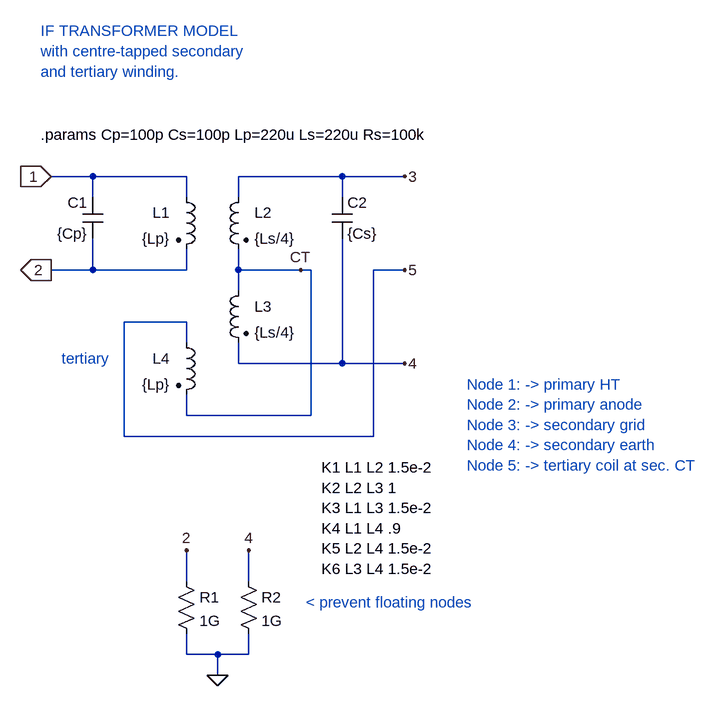
[diagram p0: schematic FM IF detector coil TX master.asc]
FM IF detector coil TX master.asc, the LTspice schematic file:
Version 4
SHEET 1 1056 868
WIRE -128 -48 -192 -48
WIRE 16 -48 -128 -48
WIRE 256 -48 96 -48
WIRE 352 -48 256 -48
WIRE -128 -16 -128 -48
WIRE 16 -16 16 -48
WIRE 96 -16 96 -48
WIRE 256 -16 256 -48
WIRE -128 96 -128 48
WIRE -128 96 -192 96
WIRE 16 96 16 64
WIRE 16 96 -128 96
WIRE 96 96 96 64
WIRE 192 96 96 96
WIRE 208 96 192 96
WIRE 352 96 304 96
WIRE 96 128 96 96
WIRE 16 176 -80 176
WIRE 16 208 16 176
WIRE 96 240 96 208
WIRE 256 240 256 48
WIRE 256 240 96 240
WIRE 352 240 256 240
WIRE 16 320 16 288
WIRE 208 320 208 96
WIRE 208 320 16 320
WIRE -80 352 -80 176
WIRE 304 352 304 96
WIRE 304 352 -80 352
WIRE 16 576 16 528
WIRE 112 576 112 528
WIRE 16 688 16 656
WIRE 64 688 16 688
WIRE 112 688 112 656
WIRE 112 688 64 688
WIRE 64 720 64 688
FLAG 64 720 0
FLAG 16 528 2
FLAG 112 528 4
FLAG -192 -48 1
IOPIN -192 -48 In
FLAG -192 96 2
IOPIN -192 96 Out
FLAG 352 -48 3
FLAG 352 240 4
FLAG 352 96 5
FLAG 192 96 CT
SYMBOL res 0 560 R0
SYMATTR InstName R1
SYMATTR Value 1G
SYMBOL res 96 560 R0
SYMATTR InstName R2
SYMATTR Value 1G
SYMBOL ind2 0 -32 R0
WINDOW 0 -9 40 Right 0
WINDOW 3 -9 80 Right 0
SYMATTR InstName L1
SYMATTR Value {Lp}
SYMATTR Type ind
SYMATTR SpiceLine Rser=1 Rpar=100k
SYMBOL ind2 112 -32 M0
WINDOW 0 -9 40 Right 0
WINDOW 3 -9 80 Right 0
SYMATTR InstName L2
SYMATTR Value {Ls/4}
SYMATTR Type ind
SYMATTR SpiceLine Rser=1 Rpar={Rs/2}
SYMBOL ind2 112 112 M0
WINDOW 0 -9 40 Right 0
WINDOW 3 -9 80 Right 0
SYMATTR InstName L3
SYMATTR Value {Ls/4}
SYMATTR Type ind
SYMATTR SpiceLine Rser=1 Rpar={Rs/2}
SYMBOL cap -112 -16 M0
SYMATTR InstName C1
SYMATTR Value {Cp}
SYMBOL cap 240 -16 R0
SYMATTR InstName C2
SYMATTR Value {Cs}
SYMBOL ind2 0 192 R0
WINDOW 0 -9 40 Right 0
WINDOW 3 -9 80 Right 0
SYMATTR InstName L4
SYMATTR Value {Lp}
SYMATTR Type ind
SYMATTR SpiceLine Rser=1
TEXT -208 -272 Left 0 ;IF TRANSFORMER MODEL\nwith centre-tapped secondary\nand tertiary winding.
TEXT 448 272 Left 0 ;Node 1: -> primary HT\nNode 2: -> primary anode\nNode 3: -> secondary grid\nNode 4: -> secondary earth\nNode 5: -> tertiary coil at sec. CT
TEXT 200 608 Left 0 ;< prevent floating nodes
TEXT -208 -112 Left 0 !.params Cp=100p Cs=100p Lp=220u Ls=220u Rs=100k
TEXT -176 232 Left 0 ;tertiary
TEXT 224 400 Left 0 !K1 L1 L2 1.5e-2\nK2 L2 L3 1\nK3 L1 L3 1.5e-2\nK4 L1 L4 .9\nK5 L2 L4 1.5e-2\nK6 L3 L4 1.5e-2

The netlist it stands for:
* FM IF detector coil TX master.asc
R1 2 0 1G
R2 4 0 1G
L1 1 2 {Lp} Rser=1 Rpar=100k
L2 3 CT {Ls/4} Rser=1 Rpar={Rs/2}
L3 CT 4 {Ls/4} Rser=1 Rpar={Rs/2}
C1 1 2 {Cp}
C2 3 4 {Cs}
L4 5 CT {Lp} Rser=1
* IF TRANSFORMER MODEL
* with centre-tapped secondary
* and tertiary winding.
* Node 1: -> primary HT
* Node 2: -> primary anode
* Node 3: -> secondary grid
* Node 4: -> secondary earth
* Node 5: -> tertiary coil at sec. CT
* < prevent floating nodes
.params Cp=100p Cs=100p Lp=220u Ls=220u Rs=100k
* tertiary
K1 L1 L2 1.5e-2
K2 L2 L3 1
K3 L1 L3 1.5e-2
K4 L1 L4 .9
K5 L2 L4 1.5e-2
K6 L3 L4 1.5e-2
.backanno
.end